# Altium schematic sheet SuperCapV0.SchDoc
size A4
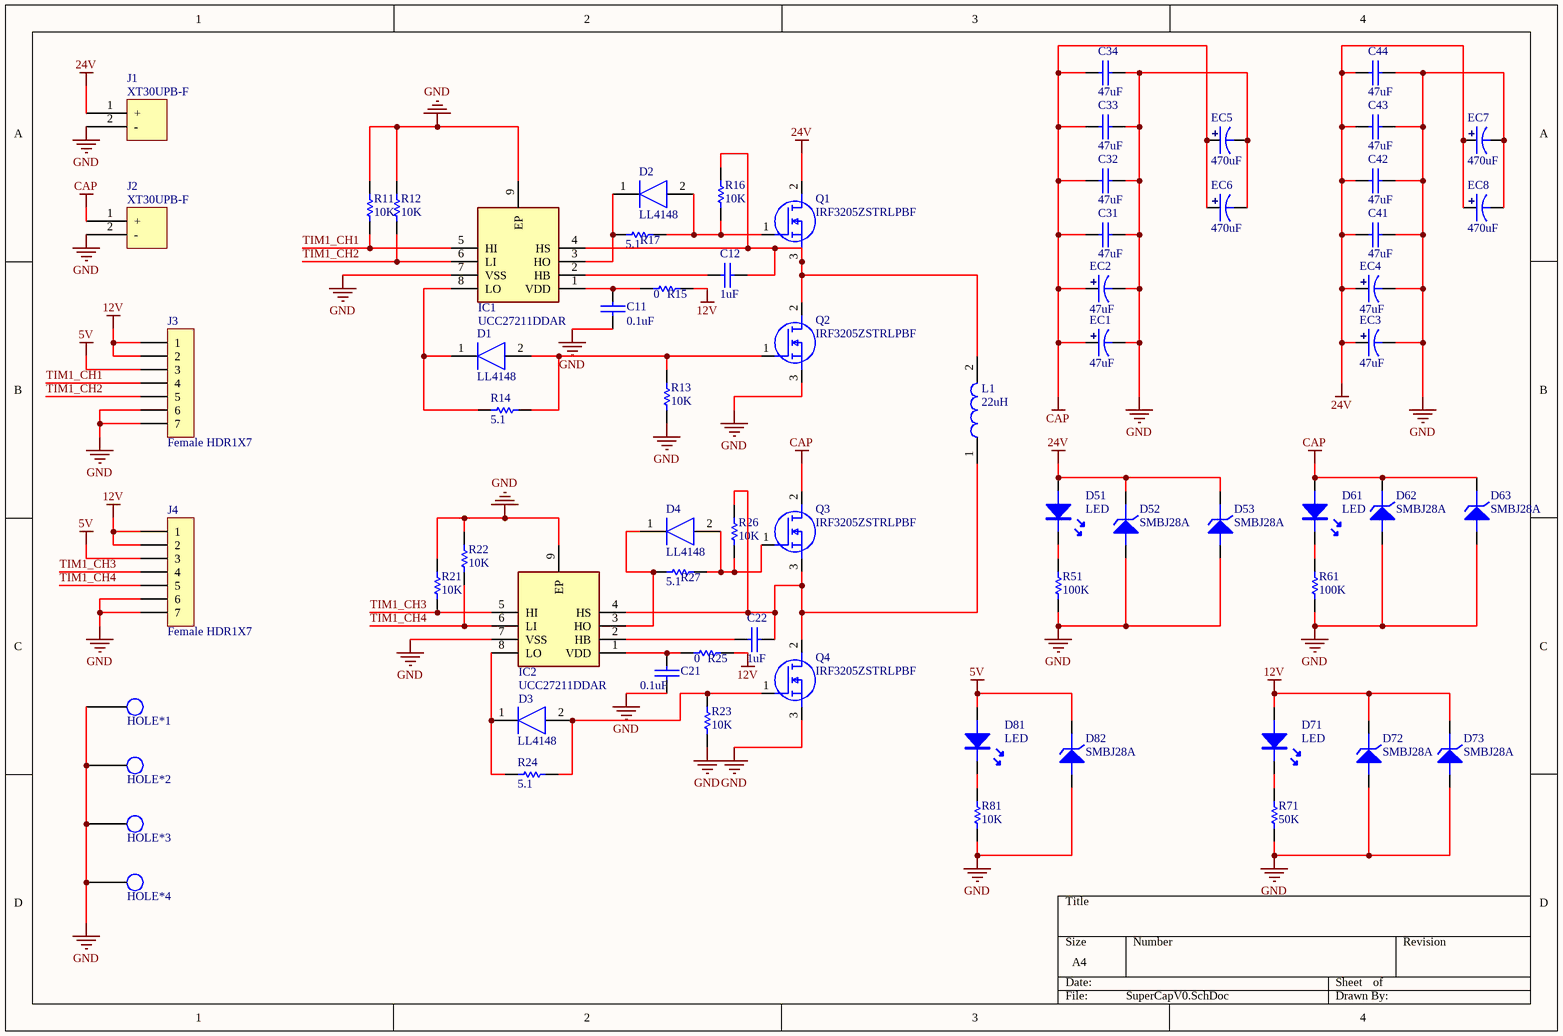
[diagram p0: SuperCapV0.SchDoc]

## Parts
C11  0.1uF  [0603C]
C12  1uF  [0603C]
C21  0.1uF  [0603C]
C22  1uF  [0603C]
C31  47uF  [1812C]
C32  47uF  [1812C]
C33  47uF  [1812C]
C34  47uF  [1812C]
C41  47uF  [1812C]
C42  47uF  [1812C]
C43  47uF  [1812C]
C44  47uF  [1812C]
D1  LL4148  [FDLL4448]
D2  LL4148  [FDLL4448]
D3  LL4148  [FDLL4448]
D4  LL4148  [FDLL4448]
D51  LED  [LED-0603G]
D52  SMBJ28A  [SMC/DO-214AB]
D53  SMBJ28A  [SMC/DO-214AB]
D61  LED  [LED-0603G]
D62  SMBJ28A  [SMC/DO-214AB]
D63  SMBJ28A  [SMC/DO-214AB]
D71  LED  [LED-0603G]
D72  SMBJ28A  [SMC/DO-214AB]
D73  SMBJ28A  [SMC/DO-214AB]
D81  LED  [LED-0603G]
D82  SMBJ28A  [SMC/DO-214AB]
EC1  47uF  [SMD-EC10X10X10]
EC2  47uF  [SMD-EC10X10X10]
EC3  47uF  [SMD-EC10X10X10]
EC4  47uF  [SMD-EC10X10X10]
EC5  470uF  [DIP-EC5.0X10X16-A]
EC6  470uF  [DIP-EC5.0X10X16-A]
EC7  470uF  [DIP-EC5.0X10X16-A]
EC8  470uF  [DIP-EC5.0X10X16-A]
HOLE*1  Hole  [M3]  (value not drawn)
HOLE*2  Hole  [M3]  (value not drawn)
HOLE*3  Hole  [M3]  (value not drawn)
HOLE*4  Hole  [M3]  (value not drawn)
IC1  UCC27211DDAR  [SOIC127P600X170-9N]
IC2  UCC27211DDAR  [SOIC127P600X170-9N]
J1  XT30UPB-F  [XT30UPB-F]  (value not drawn)
J2  XT30UPB-F  [XT30UPB-F]  (value not drawn)
J3  Female HDR1X7  [Fe-HDR1X7/2.54-S]
J4  Female HDR1X7  [Fe-HDR1X7/2.54-S]
L1  22uH  [INDPM180170X700N]
Q1  IRF3205ZSTRLPBF  [IDB30E60]
Q2  IRF3205ZSTRLPBF  [IDB30E60]
Q3  IRF3205ZSTRLPBF  [IDB30E60]
Q4  IRF3205ZSTRLPBF  [IDB30E60]
R11  10K  [0603R]
R12  10K  [0603R]
R13  10K  [0603R]
R14  5.1  [0603R]
R15  0  [0603R]
R16  10K  [0603R]
R17  5.1  [0603R]
R21  10K  [0603R]
R22  10K  [0603R]
R23  10K  [0603R]
R24  5.1  [0603R]
R25  0  [0603R]
R26  10K  [0603R]
R27  5.1  [0603R]
R51  100K  [0603R]
R61  100K  [0603R]
R71  50K  [0603R]
R81  10K  [0603R]

## Nets
5V: D81.A D82.K J3.3 J4.3
12V: D71.A D72.K D73.K J3.1 J3.2 J4.1 J4.2 R15.2 R25.2
24V: C41.1 C42.1 C43.1 C44.1 D51.A D52.K D53.K EC3.1 EC4.1 EC7.1 EC8.1 J1.1(+) Q1.2(D)
CAP: C31.1 C32.1 C33.1 C34.1 D61.A D62.K D63.K EC1.1 EC2.1 EC5.1 EC6.1 J2.1(+) Q3.2(D)
GND: C11.1 C21.1 C31.2 C32.2 C33.2 C34.2 C41.2 C42.2 C43.2 C44.2 D52.A D53.A D62.A D63.A D72.A D73.A D82.A EC1.2 EC2.2 EC3.2 EC4.2 EC5.2 EC6.2 EC7.2 EC8.2 HOLE*1.1 HOLE*2.1 HOLE*3.1 HOLE*4.1 IC1.7(VSS) IC1.9(EP) IC2.7(VSS) IC2.9(EP) J1.2(-) J2.2(-) J3.6 J3.7 J4.6 J4.7 Q2.3(S) Q4.3(S) R11.2 R12.2 R13.1 R21.2 R22.2 R23.1 R51.1 R61.1 R71.1 R81.1
TIM1_CH1: IC1.5(HI) J3.4 R11.1
TIM1_CH2: IC1.6(LI) J3.5 R12.1
TIM1_CH3: IC2.5(HI) J4.4 R21.1
TIM1_CH4: IC2.6(LI) J4.5 R22.1
NetC11_2: C11.2 IC1.1(VDD) R15.1
NetC12_1: C12.1 IC1.4(HS) L1.2 Q1.3(S) Q2.2(D) R16.2
NetC12_2: C12.2 IC1.2(HB)
NetC21_2: C21.2 IC2.1(VDD) R25.1
NetC22_1: C22.1 IC2.4(HS) L1.1 Q3.3(S) Q4.2(D) R26.2
NetC22_2: C22.2 IC2.2(HB)
NetD1_1: D1.1(K) IC1.8(LO) R14.1
NetD1_2: D1.2(A) Q2.1(G) R13.2 R14.2
NetD2_1: D2.1(K) IC1.3(HO) R17.1
NetD2_2: D2.2(A) Q1.1(G) R16.1 R17.2
NetD3_1: D3.1(K) IC2.8(LO) R24.1
NetD3_2: D3.2(A) Q4.1(G) R23.2 R24.2
NetD4_1: D4.1(K) IC2.3(HO) R27.1
NetD4_2: D4.2(A) Q3.1(G) R26.1 R27.2
NetD51_K: D51.K R51.2
NetD61_K: D61.K R61.2
NetD71_K: D71.K R71.2
NetD81_K: D81.K R81.2

## Library data of the parts
C11 C12 C21 C22 C31-C34 C41-C44 = CAP: 无极性电容
D1-D4 = LL4148: Diode; Manufacturer_Name: ON Semiconductor; Datasheet Link: https://www.onsemi.com/pub/Collateral/LL4148-D.pdf; Height: 1mm; Manufacturer_Part_Number: LL4148; Mouser Part Number: 512-LL4148; Mouser Price/Stock: https://www.mouser.co.uk/ProductDetail/ON-Semiconductor-Fairchild/LL4148?qs=z%2Fr5wmDnQfY5jXgsdLPkRg%3D%3D; Arrow Part Number: LL4148; Arrow Price/Stock: https://www.arrow.com/en/products/ll4148/on-semiconductor?region=asia
D52 D53 D62 D63 D72 D73 D82 = DIODE ZENER: 稳压二极管
EC1-EC4 = SMD_ECAP: 贴片电解电容
EC5-EC8 = DIP_ECAP: 直插电解电容
IC1 IC2 = UCC27211DDAR: Integrated Circuit; Manufacturer_Name: Texas Instruments; Datasheet Link: http://www.ti.com/lit/gpn/UCC27211; Height: 1.7mm; Manufacturer_Part_Number: UCC27211DDAR; Mouser Part Number: 595-UCC27211DDAR; Mouser Price/Stock: https://www.mouser.co.uk/ProductDetail/Texas-Instruments/UCC27211DDAR?qs=o1A9MY8yOkUTp5ljYZfoNg%3D%3D; Arrow Part Number: UCC27211DDAR; Arrow Price/Stock: https://www.arrow.com/en/products/ucc27211ddar/texas-instruments
L1 = BCIHP1770-100M: Inductor; Manufacturer_Name: BC(Bao Cheng Elec); Datasheet Link: https://datasheet.lcsc.com/szlcsc/Bao-Cheng-Elec-BC-BCIHP1770-100M_C237980.pdf; Height: 7mm; Manufacturer_Part_Number: BCIHP1770-100M
Q1-Q4 = IRF3205ZSTRLPBF: MOSFET (N-Channel); Manufacturer_Name: Infineon; Datasheet Link: https://www.infineon.com/dgdl/irf3205zpbf.pdf?fileId=5546d462533600a4015355df030c190f; Manufacturer_Part_Number: IRF3205ZSTRLPBF; Mouser Part Number: 942-IRF3205ZSTRLPBF; Mouser Price/Stock: https://www.mouser.co.uk/ProductDetail/Infineon-IR/IRF3205ZSTRLPBF?qs=2r01AXMCG3MP3VtI3Ve68w%3D%3D; Arrow Part Number: IRF3205ZSTRLPBF; Arrow Price/Stock: https://www.arrow.com/en/products/irf3205zstrlpbf/infineon-technologies-ag?region=nac
R11-R17 R21-R27 R51 R61 R71 R81 = RES